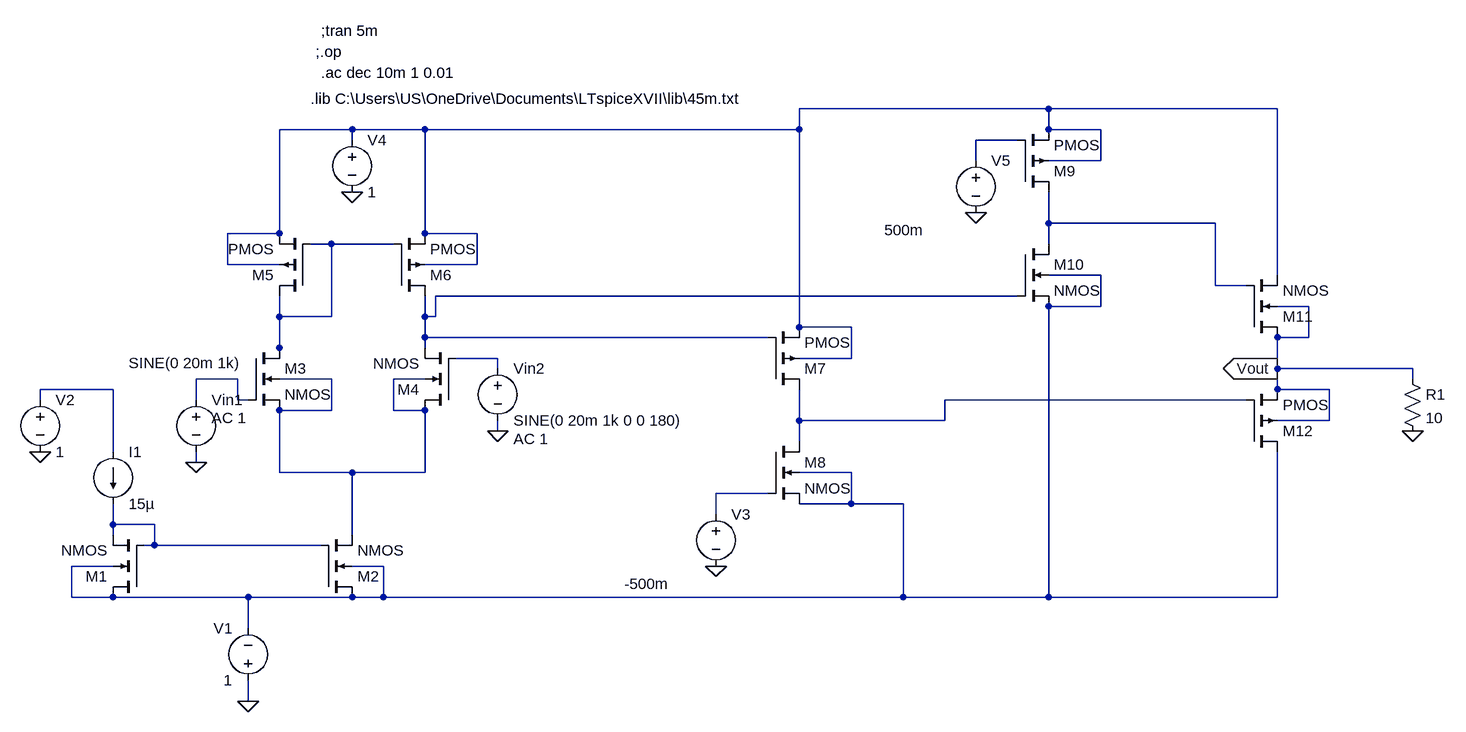
[diagram p0: schematic OpAmp.asc]
OpAmp.asc, the LTspice schematic file:
Version 4
SHEET 1 1960 680
WIRE 1344 -448 960 -448
WIRE 1696 -448 1344 -448
WIRE 272 -416 160 -416
WIRE 384 -416 272 -416
WIRE 960 -416 960 -448
WIRE 960 -416 384 -416
WIRE 1344 -416 1344 -448
WIRE 1424 -416 1344 -416
WIRE 272 -400 272 -416
WIRE 1296 -400 1232 -400
WIRE 1232 -368 1232 -400
WIRE 1424 -368 1424 -416
WIRE 1424 -368 1344 -368
WIRE 1344 -272 1344 -320
WIRE 1600 -272 1344 -272
WIRE 160 -256 160 -416
WIRE 160 -256 80 -256
WIRE 384 -256 384 -416
WIRE 464 -256 384 -256
WIRE 240 -240 208 -240
WIRE 336 -240 240 -240
WIRE 1344 -240 1344 -272
WIRE 80 -208 80 -256
WIRE 160 -208 80 -208
WIRE 464 -208 464 -256
WIRE 464 -208 384 -208
WIRE 1424 -192 1344 -192
WIRE 1696 -192 1696 -448
WIRE 1600 -176 1600 -272
WIRE 1648 -176 1600 -176
WIRE 1296 -160 400 -160
WIRE 1424 -144 1424 -192
WIRE 1424 -144 1344 -144
WIRE 1744 -144 1696 -144
WIRE 160 -128 160 -160
WIRE 240 -128 240 -240
WIRE 240 -128 160 -128
WIRE 384 -128 384 -160
WIRE 400 -128 400 -160
WIRE 400 -128 384 -128
WIRE 960 -112 960 -416
WIRE 1040 -112 960 -112
WIRE 384 -96 384 -128
WIRE 912 -96 384 -96
WIRE 1744 -96 1744 -144
WIRE 1744 -96 1696 -96
WIRE 160 -80 160 -128
WIRE 384 -80 384 -96
WIRE 160 -64 160 -80
WIRE 496 -64 432 -64
WIRE 1040 -64 1040 -112
WIRE 1040 -64 960 -64
WIRE 496 -48 496 -64
WIRE 1696 -48 1696 -96
WIRE 1904 -48 1696 -48
WIRE 96 -32 32 -32
WIRE 240 -32 160 -32
WIRE 384 -32 336 -32
WIRE 1904 -32 1904 -48
WIRE -96 -16 -208 -16
WIRE 1696 -16 1696 -48
WIRE 1776 -16 1696 -16
WIRE -208 0 -208 -16
WIRE 32 0 32 -32
WIRE 96 0 96 -32
WIRE 112 0 96 0
WIRE 1648 0 1184 0
WIRE 240 16 240 -32
WIRE 240 16 160 16
WIRE 336 16 336 -32
WIRE 384 16 336 16
WIRE 960 32 960 -16
WIRE 1184 32 1184 0
WIRE 1184 32 960 32
WIRE 1776 32 1776 -16
WIRE 1776 32 1696 32
WIRE 496 48 496 32
WIRE 960 64 960 32
WIRE -96 80 -96 -16
WIRE 32 96 32 80
WIRE 160 112 160 16
WIRE 272 112 160 112
WIRE 384 112 384 16
WIRE 384 112 272 112
WIRE 1040 112 960 112
WIRE 912 144 832 144
WIRE 1040 160 1040 112
WIRE 1040 160 960 160
WIRE 1120 160 1040 160
WIRE 832 176 832 144
WIRE -96 192 -96 160
WIRE -32 192 -96 192
WIRE -96 208 -96 192
WIRE 272 208 272 112
WIRE -32 224 -32 192
WIRE -32 224 -48 224
WIRE 224 224 -32 224
WIRE -96 256 -160 256
WIRE 320 256 272 256
WIRE -160 304 -160 256
WIRE -96 304 -160 304
WIRE 112 304 -96 304
WIRE 272 304 112 304
WIRE 320 304 320 256
WIRE 320 304 272 304
WIRE 1120 304 1120 160
WIRE 1120 304 320 304
WIRE 1344 304 1344 -144
WIRE 1344 304 1120 304
WIRE 1696 304 1696 80
WIRE 1696 304 1344 304
WIRE 112 352 112 304
WIRE 112 464 112 432
FLAG 272 -320 0
FLAG 112 464 0
FLAG -208 80 0
FLAG 32 96 0
FLAG 496 48 0
FLAG 832 256 0
FLAG 1232 -288 0
FLAG 1696 -48 Vout
IOPIN 1696 -48 Out
FLAG 1904 48 0
SYMBOL current -96 80 R0
WINDOW 123 0 0 Left 0
WINDOW 39 0 0 Left 0
SYMATTR InstName I1
SYMATTR Value 15µ
SYMBOL nmos4 -48 304 R180
SYMATTR InstName M1
SYMATTR Value2 l=360n w=360n
SYMBOL nmos4 224 304 M180
SYMATTR InstName M2
SYMATTR Value2 l=360n w=360n
SYMBOL nmos4 112 -80 R0
SYMATTR InstName M3
SYMATTR Value2 l=180n w=180n
SYMBOL nmos4 432 16 R180
SYMATTR InstName M4
SYMATTR Value2 l=180n w=180n
SYMBOL pmos4 208 -160 R180
SYMATTR InstName M5
SYMATTR Value2 l=180n w=300n
SYMBOL pmos4 336 -160 M180
SYMATTR InstName M6
SYMATTR Value2 l=180n w=300n
SYMBOL voltage 112 448 R180
WINDOW 0 24 96 Left 2
WINDOW 3 24 16 Left 2
WINDOW 123 0 0 Left 0
WINDOW 39 0 0 Left 0
SYMATTR InstName V1
SYMATTR Value 1
SYMBOL voltage -208 -16 R0
WINDOW 123 0 0 Left 0
WINDOW 39 0 0 Left 0
SYMATTR InstName V2
SYMATTR Value 1
SYMBOL voltage 272 -416 R0
WINDOW 123 0 0 Left 0
WINDOW 39 0 0 Left 0
SYMATTR InstName V4
SYMATTR Value 1
SYMBOL voltage 32 -16 R0
WINDOW 3 -104 -41 Left 2
WINDOW 123 24 44 Left 2
WINDOW 39 0 0 Left 0
SYMATTR Value SINE(0 20m 1k)
SYMATTR Value2 AC 1
SYMATTR InstName Vin1
SYMBOL voltage 496 -64 R0
WINDOW 123 24 124 Left 2
WINDOW 39 0 0 Left 0
SYMATTR Value2 AC 1
SYMATTR InstName Vin2
SYMATTR Value SINE(0 20m 1k 0 0 180)
SYMBOL pmos4 912 -16 M180
SYMATTR Value2 l=180n w=300n
SYMATTR InstName M7
SYMBOL nmos4 912 64 R0
SYMATTR Value2 l=180n w=890n
SYMATTR InstName M8
SYMBOL voltage 832 160 R0
WINDOW 3 -141 123 Left 2
WINDOW 123 0 0 Left 0
WINDOW 39 0 0 Left 0
SYMATTR Value -500m
SYMATTR InstName V3
SYMBOL pmos4 1296 -320 M180
SYMATTR Value2 l=180n w=62u
SYMATTR InstName M9
SYMBOL nmos4 1296 -240 R0
SYMATTR Value2 l=180n w=180n
SYMATTR InstName M10
SYMBOL voltage 1232 -384 R0
WINDOW 3 -141 123 Left 2
WINDOW 123 0 0 Left 0
WINDOW 39 0 0 Left 0
SYMATTR Value 500m
SYMATTR InstName V5
SYMBOL nmos4 1648 -96 M180
SYMATTR Value2 l=90n w=450u
SYMATTR InstName M11
SYMBOL pmos4 1648 80 M180
SYMATTR Value2 l=90n w=750u
SYMATTR InstName M12
SYMBOL res 1888 -48 R0
SYMATTR InstName R1
SYMATTR Value 10
TEXT 208 -464 Left 2 !.lib C:\\Users\\US\\OneDrive\\Documents\\LTspiceXVII\\lib\\45m.txt
TEXT 224 -568 Left 2 !;tran 5m
TEXT 216 -536 Left 2 !;.op
TEXT 224 -504 Left 2 !.ac dec 10m 1 0.01

The netlist it stands for:
* OpAmp.asc
I1 N010 N013 15µ
M1 N005 N013 N013 N005 NMOS l=360n w=360n
M2 N005 N013 N009 N005 NMOS l=360n w=360n
M3 N004 N008 N009 N009 NMOS l=180n w=180n
M4 N009 N007 N006 N009 NMOS l=180n w=180n
M5 N004 N004 N001 N001 PMOS l=180n w=300n
M6 N006 N004 N001 N001 PMOS l=180n w=300n
V1 0 N005 1
V2 N010 0 1
V4 N001 0 1
Vin1 N008 0 SINE(0 20m 1k) AC 1
Vin2 N007 0 SINE(0 20m 1k 0 0 180) AC 1
M7 N011 N006 N001 N001 PMOS l=180n w=300n
M8 N011 N012 N005 N005 NMOS l=180n w=890n
V3 N012 0 -500m
M9 N003 N002 N001 N001 PMOS l=180n w=62u
M10 N003 N006 N005 N005 NMOS l=180n w=180n
V5 N002 0 500m
M11 Vout N003 N001 Vout NMOS l=90n w=450u
M12 N005 N011 Vout Vout PMOS l=90n w=750u
R1 Vout 0 10
.model NMOS NMOS
.model PMOS PMOS
.lib standard.mos
.lib C:\Users\US\OneDrive\Documents\LTspiceXVII\lib\45m.txt
;tran 5m
;.op
.ac dec 10m 1 0.01
.backanno
.end